# Altium schematic sheet Power.SchDoc
size 177 x 101 mm; SheetNumber: 8; SheetTotal: 9
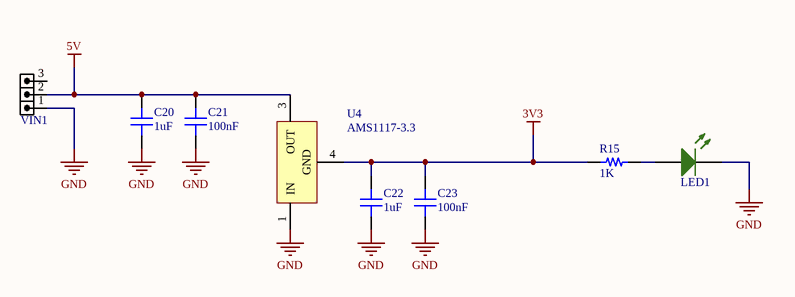
[diagram p0: Power.SchDoc]

## Parts
C20  1uF  [CAP 0805_2012]
C21  100nF  [CAP 0603_1608]
C22  1uF  [CAP 0805_2012]
C23  100nF  [CAP 0603_1608]
LED1  LED SMD 0603 GREEN  [LED_0603_GREEN]  (value not drawn)
R15  1K  [RES 0603_1608]
U4  AMS1117-3.3  [TO-252]
VIN1  HDRM3  [HDR_M_1X3]  (value not drawn)

## Nets
3V3: C22.2 C23.2 R15.1 U4.4(GND)
5V: C20.2 C21.2 U4.3(OUT) VIN1.2
GND: C20.1 C21.1 C22.1 C23.1 LED1.2(K) U4.1(IN) VIN1.1
NetLED1_1: LED1.1(A) R15.2

Not connected (* = marked no-connect by the designer): VIN1 3

## Library data of the parts
C20 C22 = Cap 0805: SMT Capacitor; VALUE: 1uF
C21 C23 = Cap 0603: SMT Capacitor; VALUE: 100nF
R15 = Res 0603: SMT Resistor; VALUE: 1K
U4 = LF33 (SMD): PartNumber: LF33CDT-TR; DatasheetVersion: Nov-2010; PackageVersion: 2011; PackageReference: TO-252; PackageDescription: 3-Pin Transistor Outline Package 2.28 mm Pitch, 9.7 mm Lead Span (DPAK); ComponentLink1Description: Manufacturer URL; ComponentLink1URL: http://www.st.com; ComponentLink2Description: Datasheet; ComponentLink2URL: http://www.st.com/internet/com/TECHNICAL_RESOURCES/TECHNICAL_LITERATURE/DATASHEET/CD00000546.pdf
VIN1 = HDR_M_1X3: CONN, HEADER, Male, pitch: 2.54mm, 3POS; VALUE: HDRM3